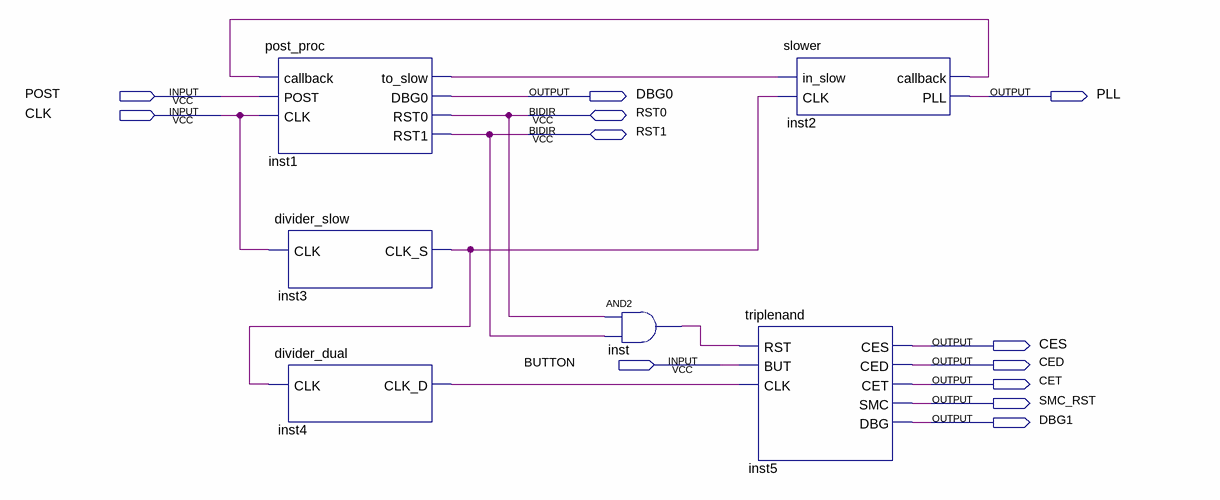
[diagram p0: schematic sheet]
// Quartus schematic main.bdf as structural Verilog: 6 symbols, 12 pins
module main (
  input  POST,
  input  CLK,
  input  BUTTON,
  inout  RST0,
  inout  RST1,
  output DBG0,
  output PLL,
  output CES,
  output CED,
  output CET,
  output SMC_RST,
  output DBG1
);

  wire inst1_to_slow, inst2_callback, inst3_clk_s, inst4_clk_d, inst_out;

  post_proc inst1 (
    .callback(inst2_callback), .POST(POST), .CLK(CLK), .to_slow(inst1_to_slow), .DBG0(DBG0), .RST0(RST0),
    .RST1(RST1));
  divider_slow inst3 (.CLK(CLK), .CLK_S(inst3_clk_s));
  divider_dual inst4 (.CLK(inst3_clk_s), .CLK_D(inst4_clk_d));
  and inst (inst_out, RST0, RST1);
  triplenand inst5 (
    .RST(inst_out), .BUT(BUTTON), .CLK(inst4_clk_d), .CES(CES), .CED(CED), .CET(CET), .SMC(SMC_RST),
    .DBG(DBG1));
  slower inst2 (.in_slow(inst1_to_slow), .CLK(inst3_clk_s), .callback(inst2_callback), .PLL(PLL));
endmodule
